# EAGLE board hot-wand (EAGLE 7.6.0)
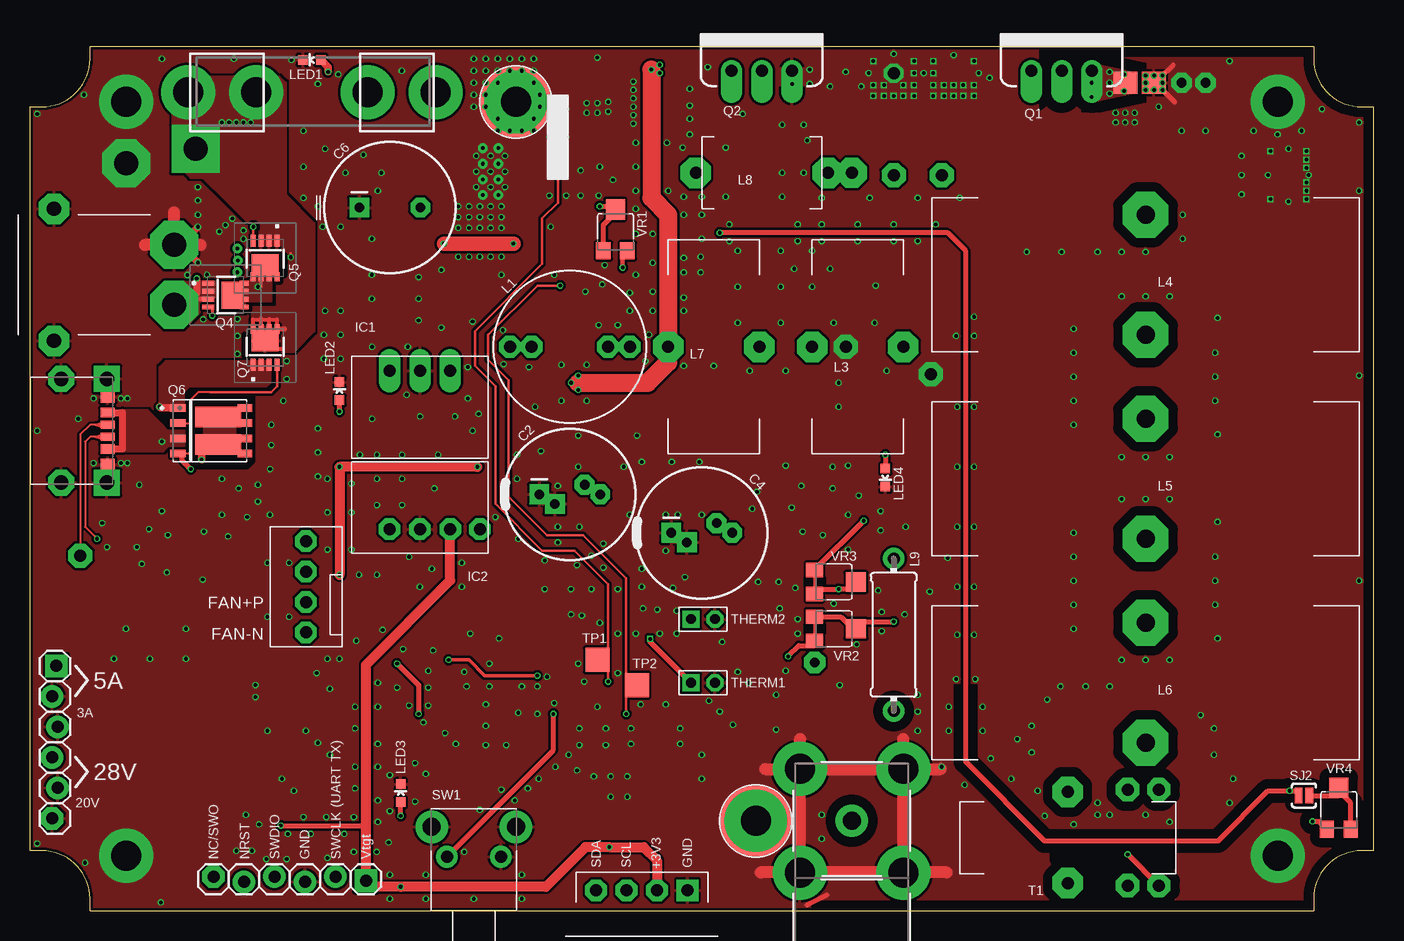
[diagram p2: board, top side]
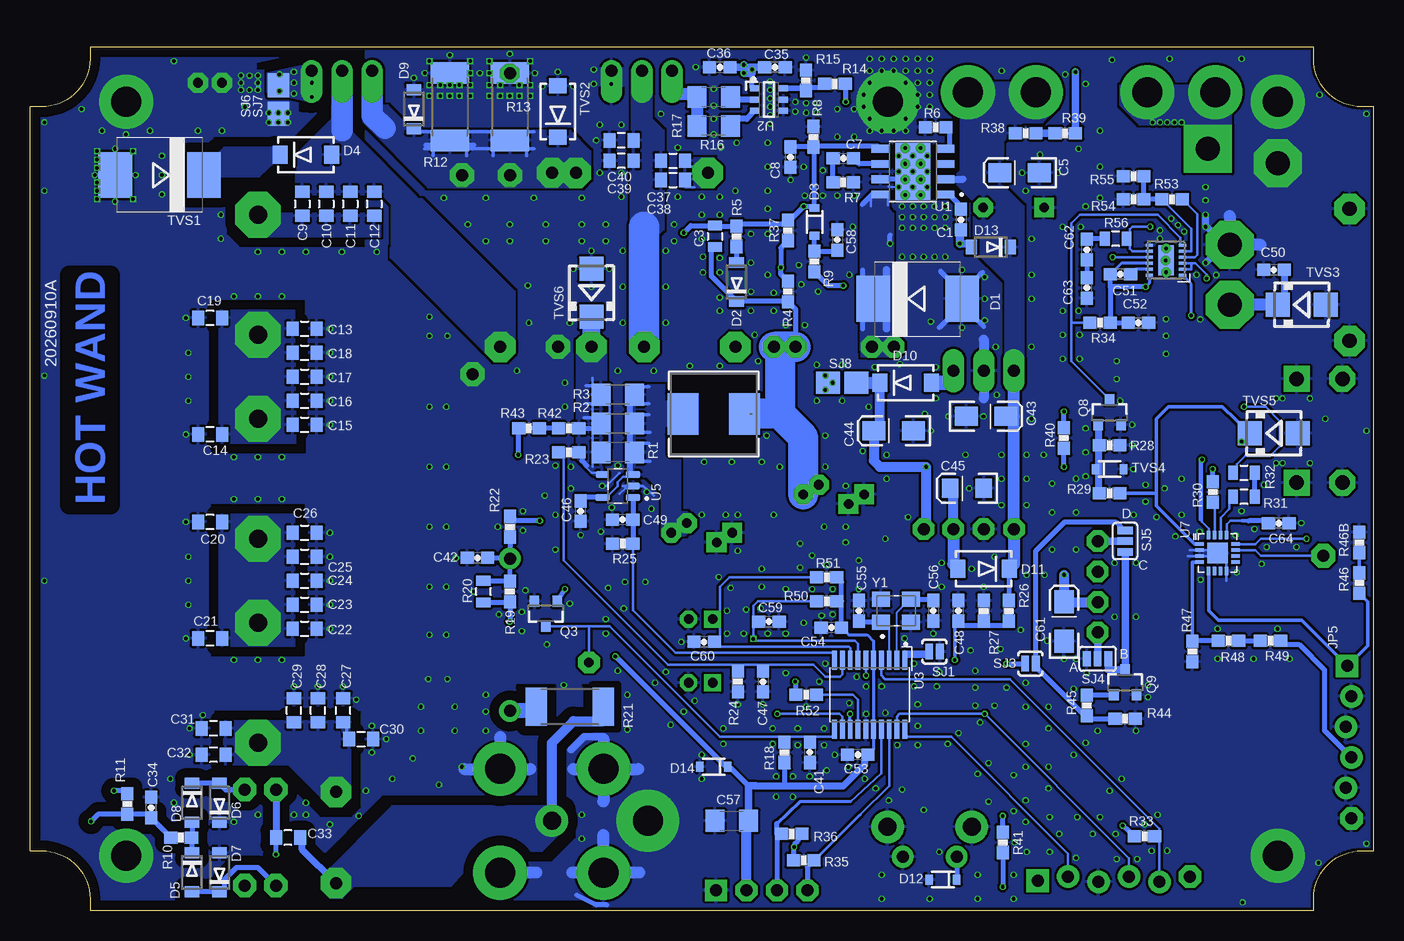
[diagram p3: board, bottom side, seen from below]

Size 112 x 72 mm. Coordinates in mm from the lower left corner, seen from the top.
Copper layers (1*16): Top 0.035mm / dielectric 1.6mm / Bottom 0.035mm
Design rules "jlcpcb-2layers *": minimum track width 5mil, minimum drill 0.3mm, track to track 5mil, track to pad 5mil, pad to pad 5mil, via to via 5mil, smd to smd 5mil, copper to edge 0.2mm, drill to drill 6mil, minimum pad ring 10mil, minimum via ring 4mil, stop-mask expansion 4mil, vias tented up to drill 0.5mm, thermal gap 8mil
tRestrict: 8 lines
bRestrict: 4 lines

## Footprints (pad centres in the part's own frame; a part is rotated, then mirrored left to right if it is on the bottom)
0603-CAP = smd 1.1 x 1: 1 -0.85,0; 2 0.85,0
CPOL-RADIAL-COMBO-10MM = drill 0.8 pad 1.651 octagon: 1 2.54,0; 1B 1.24,0.8 | drill 0.8 pad 1.651 square: 2 -2.54,0; 2B -1.24,-0.8
0805 = smd 0.8 x 1.2: 1 -0.9,0; 2 0.9,0
EIA3216-KIT = smd 1.9 x 1.6: A 1.65,0; C -1.65,0
CPOL-RADIAL-1000UF-25V = drill 0.8 pad 1.651 octagon: 1 2.54,0 | drill 0.8 pad 1.651 square: 2 -2.54,0
0805-L = smd 1 x 1.2: 1 -1,0; 2 1,0
EIA3216 = smd 1.4 x 1.6: A 1.4,0; C -1.4,0
1206 = smd 1.6 x 1.8: 1 -1.4,0; 2 1.4,0
SMC = smd 2.8 x 3.8: A 3.7,0; C -3.7,0
SOD123FL = smd 0.91 x 1.22: A 1.625,0; C -1.625,0
SOD-323 = smd 0.63 x 0.83: 1 -1.15,0; 2 1.15,0
SMA-DIODE = smd 1.27 x 1.47: A -2.15,0; C 2.15,0
FUSE_5MM = drill 2.5 pad 3.556: 1 0,-10.3; 2 0,-4.658; 3 0,4.658; 4 0,10.3
FAN-CONN-X4 = drill 1 octagon: G 0,3.8; P 0,-3.8; T 0,-1.27; V 0,1.27
TO220-BUCK-12V = drill 1 long: 1 -2.54,0; 2 0,0; 3 2.54,0
TO220-BUCK-3.3V = drill 1 octagon: 1 -2.54,0; 2 0,0; 3 2.54,0
CONN_73330-0030_MOL = drill 1.5 pad 1.753: 1 0,0 | drill 2.5 pad 3.048: 2 -4.318,4.318; 3 -4.318,-4.318; 4 4.318,-4.318; 5 4.318,4.318
SAMESKY_UJC-H-G-SMT-2-P6-TR-DRILL = smd 0.7 x 1.2: A5 -0.5,3.88; B5 0.5,3.88 | smd 0.76 x 1.2: A9 1.52,3.88; B9 -1.52,3.88 | smd 1 x 1.2: A12 2.85,3.88; B12 -2.85,3.88 | drill 1.2 pad 2 square: M1 -4.32,3.8; M3 4.32,3.8 | drill 1.2 pad 2 octagon: M2 -4.32,0; M4 4.32,0
XT30PW = drill 1.2 pad 2.54 octagon: M1 -5.5,0; M2 5.5,0 | drill 2 pad 4 octagon: N 2.5,-10; P -2.5,-10
1X06_LOCK = drill 1 pad 1.88 square: 1 0,0 | drill 1 pad 1.88: 2 2.54,-0.354; 3 5.08,0.1; 4 7.62,-0.354; 5 10.16,0.1 | drill 1 pad 1.88 octagon: 6 12.7,-0.354
IND_RADIAL_D12.7_COMBO = drill 1 octagon: 1 -3.175,0; 1B -5,0; 2 3.175,0; 2B 5,0
IND_IHLP-2525CZ_VIS-M = smd 2.616 x 3.429: 1 -2.565,0; 2 2.565,0
IND_K16X8X6_X2 = drill 1 pad 2.54 octagon: 1 0,3.8; 2 0,-3.8
IND_T130-6_X2 = drill 1.5 pad 3.81 octagon: 1 0,5; 2 0,-5
IND-10X6MM = drill 1 pad 2.54 octagon: 1 -5.5,0; 2 5.5,0
TFI0410 = drill 1 pad 1.6: 1 -6.35,0; 2 6.35,0
LED-0603 = smd 0.8 x 0.8: A 0,-0.75; C 0,0.75
PCB-OUTLINE = drill 2.5 pad 4.2: 1 8,67.4; 2 8,4.6; 3 104,67.4; 4 104,4.6
TO220V-REAR = drill 1 offset: 1 -2.54,0; 2 0,0; 3 2.54,0
SOT23-3 = smd 0.8 x 0.9: 1 -0.95,-1; 2 0.95,-1; 3 0,1.1
POWERPAK-1212-8 = smd 0.99 x 0.405: 1 -1.435,0.99; 2 -1.435,0.33; 3 -1.435,-0.33; 4 -1.435,-0.99 | smd 0.76 x 0.405: 5 1.55,-0.99; 6 1.55,-0.33; 7 1.55,0.33; 8 1.55,0.99 | smd 1.725 x 2.235: 9 0.558,0
POWERPAK-SO8-X2 = smd 1.27 x 0.61: 1 -2.67,1.905; 2 -2.67,0.635; 3 -2.67,-0.635; 4 -2.67,-1.905 | smd 1.2 x 0.61: 5 2.9,-1.905; 6 2.9,-0.635; 7 2.9,0.635; 8 2.9,1.905 | smd 3.81 x 1.7: 9 0.69,-1.15; 10 0.69,1.15
0603-RES = smd 1.1 x 1: 1 -0.85,0; 2 0.85,0
R2512 = smd 1.8 x 3.2: 1 -2.8,0; 2 2.8,0
SJ_2S-NO = smd 0.635 x 1.27: 1 -0.45,0; 2 0.45,0
SJ_3 = smd 0.635 x 1.27: 1 -0.9,0; 2 0,0; 3 0.9,0
1206-SJ = smd 2 x 1.8: 1 -1.2,0; 2 1.2,0
STANDOFF-M2.5-4.5MMHEX = drill 2.5 pad 5.2: 1 0,0 | smd 6 x 6: 2 0,0
SW_1-1825027-1 = drill 1: 1 -2.25,0; 2 2.25,0 | drill 1.5: S1 -3.505,2.49; S2 3.505,2.49
XFORMER-K16X8X6-1:14:14 = drill 1 pad 2.54 octagon: P1 0,-3.8; P2 0,3.8 | drill 1 pad 1.93 octagon: S1A -5,4; S1B -5,-4; S2A -7.6,4; S2B -7.6,-4
1X02-2MM = drill 0.8 square: 1 -1,0 | drill 0.8 octagon: 2 1,0
PAD-SQ-2MM = smd 2 x 2: 1 0,0
SMA = smd 2 x 2: A 2,0; C -2,0
VREG_LM5017MR/NOPB = smd 1.55 x 0.6: 1 -2.7,1.905; 2 -2.7,0.635; 3 -2.7,-0.635; 4 -2.7,-1.905; 5 2.7,-1.905; 6 2.7,-0.635; 7 2.7,0.635; 8 2.7,1.905 | smd 2.95 x 4.9: 9 0,0 | drill 0.3 pad 0.3: 10 -0.65,1.95; 11 0.65,1.95; 12 -0.65,0.65; 13 0.65,0.65; 14 -0.65,-0.65; 15 0.65,-0.65; 16 -0.65,-1.95; 17 0.65,-1.95
SOT95P280X145-6N-7-V = smd 0.8 x 0.5: 1 -1.2,0.95; 2 -1.2,0; 3 -1.2,-0.95; 4 1.2,-0.95; 5 1.2,0; 6 1.2,0.95
SOP65P640X120-20N = smd 1.56 x 0.41: 1 -2.88,2.925; 2 -2.88,2.275; 3 -2.88,1.625; 4 -2.88,0.975; 5 -2.88,0.325; 6 -2.88,-0.325; 7 -2.88,-0.975; 8 -2.88,-1.625; 9 -2.88,-2.275; 10 -2.88,-2.925; 11 2.88,-2.925; 12 2.88,-2.275; 13 2.88,-1.625; 14 2.88,-0.975; 15 2.88,-0.325; 16 2.88,0.325; 17 2.88,0.975; 18 2.88,1.625; 19 2.88,2.275; 20 2.88,2.925
OLED-0.91IN-VERT = drill 1 pad 1.778 square: 1 3.81,0 | drill 1 pad 1.778 octagon: 2 1.27,0; 3 -1.27,0; 4 -3.81,0
SOT95P280X145-5N = smd 1.21 x 0.59: 1 -1.255,0.95; 3 -1.255,-0.95; 5 1.255,0.95 | smd 1.1 x 0.59: 2 -1.3,0; 4 1.3,-0.95
DRR0012E-MFG = smd 0.62 x 0.25: 1 -1.39,1.25; 2 -1.39,0.75; 3 -1.39,0.25; 4 -1.39,-0.25; 5 -1.39,-0.75; 6 -1.39,-1.25; 7 1.39,-1.25; 8 1.39,-0.75; 9 1.39,-0.25; 10 1.39,0.25; 11 1.39,0.75; 12 1.39,1.25 | smd 1.3 x 2.5: 13 0,0 | drill 0.3: 14 0,-0.991; 15 0.025,0; 16 0,0.991
QFN3030-16 = smd 0.7 x 0.3: 1 -1.5,0.75; 2 -1.5,0.25; 3 -1.5,-0.25; 4 -1.5,-0.75; 9 1.5,-0.75; 10 1.5,-0.25; 11 1.5,0.25; 12 1.5,0.75 | smd 0.3 x 0.7: 5 -0.75,-1.5; 6 -0.25,-1.5; 7 0.25,-1.5; 8 0.75,-1.5; 13 0.75,1.5; 14 0.25,1.5; 15 -0.25,1.5; 16 -0.75,1.5 | smd 1.7 x 1.7: EXP 0,0
TRIM_35WR1KLFTR_V2 = smd 1.4 x 1.2: 1 -1.7,1; 3 -1.7,-1 | smd 1.7 x 1.6: 2 1.75,0
TRIM_35WR1KLFTR_V3 = smd 1.4 x 1.2: 1 -1.7,1; 3 -1.7,-1 | smd 1.7 x 1.6: 2 1.75,0
XTAL-4SMD-3.2X2.5-V2 = smd 1.25 x 1.5: 1 -0.975,1.25; 2 -0.975,-1.25; 3 0.975,-1.25; 4 0.975,1.25

## Placement (x,y rotation side)
C1  100nF  [0603-CAP]  34.4,57.6 270 bottom
C2  100uF 50V  [CPOL-RADIAL-COMBO-10MM]  45,34.7 0 top
C3  15nF (DNP)  [0805]  54.9,56.2 270 bottom
C4  100uF 50V  [CPOL-RADIAL-COMBO-10MM]  56,31.5 0 top
C5  10u  [EIA3216-KIT]  29.5,61.5 180 bottom
C6  470uF  [CPOL-RADIAL-1000UF-25V]  30,58.6 0 top
C7  100n  [0603-CAP]  44.2,62.7 0 bottom
C8  3n3  [0603-CAP]  48.6,62.8 90 bottom
C9  100nF  [0805-L]  89.3,58.9 270 bottom
C10  100nF  [0805-L]  87.3,58.9 270 bottom
C11  100nF  [0805-L]  85.3,58.9 270 bottom
C12  100nF  [0805-L]  83.3,58.9 270 bottom
C13  100pF 1000V  [0805-L]  89.1,48.5 0 bottom
C14  100pF 1000V  [0805-L]  97,39.7 180 bottom
C15  100pF 1000V  [0805-L]  89.1,40.5 0 bottom
C16  100pF 1000V  [0805-L]  89.1,42.5 0 bottom
C17  100pF 1000V  [0805-L]  89.1,44.5 0 bottom
C18  100pF 1000V  [0805-L]  89.1,46.5 0 bottom
C19  DNP  [0805-L]  97,49.4 180 bottom
C20  47pF 1000V  [0805-L]  97,32.4 180 bottom
C21  47pF 1000V  [0805-L]  97,22.7 180 bottom
C22  47pF 1000V  [0805-L]  89.1,23.5 0 bottom
C23  47pF 1000V  [0805-L]  89.1,25.5 0 bottom
C24  47pF 1000V  [0805-L]  89.1,27.5 0 bottom
C25  47pF 1000V  [0805-L]  89.1,29.5 0 bottom
C26  100pF 1000V  [0805-L]  89.1,31.5 0 bottom
C27  47pF 1000V  [0805-L]  85.9,16.7 90 bottom
C28  47pF 1000V  [0805-L]  88,16.7 90 bottom
C29  47pF 1000V  [0805-L]  90,16.7 90 bottom
C30  47pF 1000V  [0805-L]  84.4,14.3 0 bottom
C31  47pF 1000V  [0805-L]  96.7,15.2 180 bottom
C32  DNP  [0805-L]  96.7,13 180 bottom
C33  10pF 500V  [0805-L]  90.5,6.1 180 bottom
C34  1uF  [0603-CAP]  101.9,8.6 90 bottom
C35  100n  [0603-CAP]  49.9,70.3 180 bottom
C36  1uF  [0603-CAP]  54.5,70.3 0 bottom
C37  100nF  [0805-L]  58.4,60.9 0 bottom
C38  100nF  [0805-L]  58.4,62.5 0 bottom
C39  100pF  [0805-L]  62.7,62.5 180 bottom
C40  100pF  [0805-L]  62.7,64.2 180 bottom
C41  3n3  [0603-CAP]  47,13.2 270 bottom
C42  33nF  [0603-CAP]  74.7,29.4 180 bottom
C43  10u  [EIA3216-KIT]  32.3,41.2 0 bottom
C44  10u  [EIA3216-KIT]  40,40 180 bottom
C45  10u  [EIA3216]  33.9,35.2 180 bottom
C46  1uF  [0603-CAP]  66.1,33.3 90 bottom
C47  100n  [0603-CAP]  50.9,19.1 270 bottom
C48  100n  [0603-CAP]  34.6,25 90 bottom
C49  100n  [0603-CAP]  62.6,32.6 180 bottom
C50  100n  [0603-CAP]  8.3,53.4 180 bottom
C51  100n  [0603-CAP]  21.1,53.04 180 bottom
C52  100n  [0603-CAP]  19.6,49 0 bottom
C53  100n  [0603-CAP]  43,13 180 bottom
C54  100n  [0603-CAP]  45.2,23.6 180 bottom
C55  10p  [0603-CAP]  42.9,25 90 bottom
C56  10p  [0603-CAP]  36.7,25 270 bottom
C57  10u  [1206]  53.5,7.5 0 bottom
C58  3n3  [0603-CAP]  44.7,55.9 270 bottom
C59  100n  [0603-CAP]  50.4,24.1 0 bottom
C60  100n  [0603-CAP]  55.8,22.4 180 bottom
C61  10u  [EIA3216-KIT]  25.8,24.1 90 bottom
C62  100n  [0603-CAP]  23.9,55.1 90 bottom
C63  100n  [0603-CAP]  23.9,51.9 90 bottom
C64  100n  [0603-CAP]  7.9,32.3 180 bottom
D1  STPS3L60S  [SMC]  38,51 0 bottom
D2  BZT52C24  [SOD123FL]  53.1,52.4 90 bottom
D3  SD103A  [SOD-323]  46.6,57.4 270 bottom
D4  ES1J  [SMA-DIODE]  89,63 180 bottom
D5  4148  [SOD123FL]  98.5,3.2 270 bottom
D6  4148  [SOD123FL]  98.5,9 270 bottom
D7  1N4148W  [SOD123FL]  96.2,3.2 90 bottom
D8  4148  [SOD123FL]  96.2,9 90 bottom
D9  STPS0540Z  [SOD123FL]  80,66.8 90 bottom
D10  2A  [SMA-DIODE]  39,44 180 bottom
D11  [SMA-DIODE]  32.5,28.5 0 bottom
D12  3V6  [SOD-323]  35.9,2.6 180 bottom
D13  2A 60V  [SOD123FL]  31.9,55.3 180 bottom
D14  3V6  [SOD-323]  55,12 180 bottom
F1  8A 20x5mm  [FUSE_5MM]  23.5,68.2 270 top
FAN1  FAN-CONN-X4-CONN-X4  [FAN-CONN-X4]  23,27 180 top
IC1  12V R-78K12-2.0  [TO220-BUCK-12V]  32.5,45 0 top
IC2  3V3 R-78K3.3  [TO220-BUCK-3.3V]  32.5,31.8 0 top
JP1  COAX-FTYPE-PCB-MNT  [CONN_73330-0030_MOL]  68.5,7.5 180 top
JP2  USBC-CHGONLY-4M-DRILL  [SAMESKY_UJC-H-G-SMT-2-P6-TR-DRILL]  2.6,40 270 top
JP3  XT-CONNECTOR-XT30PW  [XT30PW]  2,53 90 top
JP4  [1X06_LOCK]  28,2.5 180 top
JP5  [1X06_LOCK]  2.2,20.4 270 top
L1  33u  [IND_RADIAL_D12.7_COMBO]  45,47 0 top
L2  4u7 IHLP2525CZ  [IND_IHLP-2525CZ_VIS-M]  55,41.4 180 bottom
L3  9uH  [IND_K16X8X6_X2]  69,47 270 top
L4  180nH  [IND_T130-6_X2]  93,53 0 top
L5  400nH  [IND_T130-6_X2]  93,36 0 top
L6  540nH  [IND_T130-6_X2]  93,19 0 top
L7  9uH  [IND_K16X8X6_X2]  57,47 270 top
L8  180nH  [IND-10X6MM]  61,61.5 0 top
L9  22uH  [TFI0410]  72,23 90 top
LED1  LED  [LED-0603]  23.5,70.9 90 top
LED2  LED  [LED-0603]  25.8,43.3 0 top
LED3  LED  [LED-0603]  30.9,9.8 0 top
LED4  LED  [LED-0603]  71.3,36.1 180 top
PCB1  PCB-OUTLINE  [PCB-OUTLINE]  0,0 0 top
PCB2  PCB-ART-VERSION  [PCB-ART-VERSION]  107,43.6 270 bottom
Q1  STP19NF20  [TO220V-REAR]  86,70 0 top
Q2  IRF510  [TO220V-REAR]  61,70 0 top
Q3  BC846B  [SOT23-3]  69,24.8 180 bottom
Q4  SIS862ADN-T1-GE3  [POWERPAK-1212-8]  16.3,51.3 0 top
Q5  SIS862ADN-T1-GE3  [POWERPAK-1212-8]  19.6,54.4 270 top
Q6  DMTH64M2LPDWQ-13  [POWERPAK-SO8-X2]  15,40 0 top
Q7  SIS862ADN-T1-GE3  [POWERPAK-1212-8]  19.6,46.94 90 top
Q8  2N7002K  [SOT23-3]  22,41.5 0 bottom
Q9  G3404  [SOT23-3]  20.7,19 0 bottom
R1  0R1  [1206]  63,38.2 180 bottom
R2  0R1  [1206]  63,40.6 180 bottom
R3  0R1  [1206]  63,43 180 bottom
R4  22K  [0603-RES]  48.8,51.6 270 bottom
R5  1K  [0603-RES]  53.1,56.2 270 bottom
R6  270K  [0603-RES]  36.5,65.3 0 bottom
R7  22K  [0603-RES]  44.2,60.7 180 bottom
R8  1K  [0603-RES]  46.7,64.5 270 bottom
R9  2K2  [0603-RES]  46.6,54.1 90 bottom
R10  100Ω  [0603-RES]  99.4,6.1 180 bottom
R11  2K2  [0603-RES]  103.9,8.9 270 bottom
R12  150Ω 2W  [R2512]  77,67 270 bottom
R13  DNP  [R2512]  72,67 270 bottom
R14  100Ω  [0603-RES]  44.9,68.9 180 bottom
R15  4K7  [0603-RES]  47.3,69.2 270 bottom
R16  3R6  [1206]  55,67.8 180 bottom
R17  3R6  [1206]  55,65.4 180 bottom
R18  4K7  [0603-RES]  49.1,13.2 270 bottom
R19  470Ω  [0603-RES]  72,26.6 90 bottom
R20  DNP  [0805]  74.2,26.6 90 bottom
R21  22Ω  [R2512]  67,17 180 bottom
R22  2K2  [0603-RES]  72,32 270 bottom
R23  22K  [0603-RES]  67.1,38.2 0 bottom
R24  2K2  [0603-RES]  53,19.1 90 bottom
R25  82K  [0603-RES]  62.6,30.6 0 bottom
R26  22K  [0603-RES]  30.4,25 90 bottom
R27  2K2  [0603-RES]  32.5,25 270 bottom
R28  4K7  [0603-RES]  22,38.8 180 bottom
R29  4K7  [0603-RES]  22,34.8 180 bottom
R30  4K3  [0603-RES]  13.4,34.9 270 bottom
R31  100Ω  [0805]  10.8,34.5 180 bottom
R32  100Ω  [0805]  10.8,36.5 0 bottom
R33  4K7  [0603-RES]  19.1,6.2 180 bottom
R34  22K  [0603-RES]  22.8,49 0 bottom
R35  4K7  [0603-RES]  47.5,4.2 180 bottom
R36  4K7  [0603-RES]  48.5,6.4 0 bottom
R37  DNP  [0603-RES]  48.8,56.7 270 bottom
R38  22K  [0603-RES]  29,64.8 0 bottom
R39  DNP  [0603-RES]  25.7,64.8 0 bottom
R40  4K7  [0603-RES]  25.8,39.4 90 bottom
R41  1K  [0603-RES]  30.9,5.7 90 bottom
R42  22K  [0603-RES]  67.1,40.2 180 bottom
R43  DNP  [0603-RES]  70.4,40.2 180 bottom
R44  4K7  [0603-RES]  20.7,16 0 bottom
R45  470Ω  [0603-RES]  23.9,17.1 90 bottom
R46  DNP  [0603-RES]  1.2,27.3 90 bottom
R46B  DNP  [0603-RES]  1.2,30.7 90 bottom
R47  39K  [0603-RES]  15.1,21.6 270 bottom
R48  3K  [0603-RES]  12.1,22.5 0 bottom
R49  75K  [0603-RES]  8.6,22.5 0 bottom
R50  2K2  [0603-RES]  45.6,25.8 0 bottom
R51  2K2  [0603-RES]  45.6,27.8 0 bottom
R52  100Ω  [0603-RES]  47.3,18 180 bottom
R53  82K  [0603-RES]  16.8,59.3 0 bottom
R54  3K  [0603-RES]  20,59.3 180 bottom
R55  22K  [0603-RES]  20,61.2 180 bottom
R56  100Ω  [0805]  21.5,56 180 bottom
SJ1  [SJ_2S-NO]  36.6,21.6 180 bottom
SJ2  [SJ_2S-NO]  106.2,9.6 180 top
SJ3  [SJ_2S-NO]  28.6,20.6 180 bottom
SJ4  [SJ_3]  23,21 0 bottom
SJ5  [SJ_3]  20.7,30.8 90 bottom
SJ6  SJ-SMALL-1206-SJ  [1206-SJ]  92.5,69 180 top
SJ7  SJ-SMALL-1206-SJ  [1206-SJ]  91.3,67.6 90 bottom
SJ8  SJ-SMALL-1206-SJ  [1206-SJ]  44.3,44 180 bottom
STANDOFF1  STANDOFF-M2.5-4.5MMHEX  [STANDOFF-M2.5-4.5MMHEX]  40.5,67.4 0 top
STANDOFF2  STANDOFF-M2.5-4.5MMHEX  [STANDOFF-M2.5-4.5MMHEX]  60.5,7.5 0 top
SW1  [SW_1-1825027-1]  37,4.5 0 top
T1  [XFORMER-K16X8X6-1:14:14]  86.5,6.1 180 top
THERM1  10K/~3950  [1X02-2MM]  56.1,19 0 top
THERM2  10K/~3950  [1X02-2MM]  56.1,24.3 0 top
TP1  TEST-POINT-SQ-2MM  [PAD-SQ-2MM]  47.3,20.9 0 top
TP2  TEST-POINT-SQ-2MM  [PAD-SQ-2MM]  50.6,18.8 0 top
TVS1  SM15T150CA  [SMC]  101.2,61.3 180 bottom
TVS2  SMBJ15CA  [SMA-DIODE]  68,66.6 270 bottom
TVS3  36V  [SMA]  6,50.5 0 bottom
TVS4  15V  [SOD-323]  22,36.8 0 bottom
TVS5  36V  [SMA]  8.3,39.8 0 bottom
TVS6  SMAJ24CA  [SMA]  65.2,51.5 90 bottom
U1  TPS54560DDA  [VREG_LM5017MR/NOPB]  38.4,61.6 180 bottom
U2  1EDN8511BXUSA1  [SOT95P280X145-6N-7-V]  50.4,67.6 0 bottom
U3  STM32F042F6P6  [SOP65P640X120-20N]  42,18 270 bottom
U4  SSD1306-4PIN-0.91N-VERT  [OLED-0.91IN-VERT]  51,1.7 0 top
U5  INA138  [SOT95P280X145-5N]  63,35.4 180 bottom
U6  LM74810QDRRRQ1  [DRR0012E-MFG]  17.3,54.2 180 bottom
U7  AP53781  [QFN3030-16]  13,29.8 0 bottom
VR1  10K  [TRIM_35WR1KLFTR_V2]  48.8,56.7 90 top
VR2  1K  [TRIM_35WR1KLFTR_V3]  67.1,23.5 0 top
VR3  1K  [TRIM_35WR1KLFTR_V3]  67.1,27.4 0 top
VR4  5K  [TRIM_35WR1KLFTR_V2]  109.1,8.5 90 top
Y1  27.12 MHz 10pF  [XTAL-4SMD-3.2X2.5-V2]  39.8,25 90 bottom

## Tracks (layer width: path | path; a pad name or v marks a point on that pad's centre or on a via)
3.3V  (via drill 0.3)
  Top 0.254: VR2.1 VR2.3
  Top 0.406: v20.9,7.1 28,7.1 | v63.2,21.2 64.1,22.1 65.4,22.1 VR2.3 | VR2.1 67.6,24.5 68.6,23.5 VR2.2 69.45,24.1 v72,24.1
  Top 0.813: IC2.3 35.04,27.54 28,20.5 28,7.1 JP4.1 28.5,2 v30.9,2 43,2 46.3,5.3 v48.3,5.3 51.16,5.3 52.27,4.19 U4.2
  Bottom 0.203: C57.2 52.35,7.4 52.27,7.4
  Bottom 0.254: C54.1 43.75,23 42.2,23 41.67,22.48 U3.5 U3.16 41.67,13.47 C53.1
  Bottom 0.406: R18.2 49.1,10.4 | R33.2 v20.9,7.1 | C54.1 44.35,25.8 | 44.35,25.8 44.35,27.4 R51.2 | R50.2 44.35,25.8 | v63.2,21.2 53.9,11.9 53.8,11.9 | 53.8,11.9 53.6,11.9 52.1,10.4 | D14.1 53.8,11.95 53.8,11.9 | R36.2 48,6.05 48,5.8 48.3,5.5 v48.3,5.3 48.3,4.25 R35.2 | R41.1 v30.9,2 | v72,24.1 R19.1 72,25.7 R20.1
  Bottom 0.6: 51.47,10.4 49.1,10.4 44.2,10.4 42.4,12.2 42.4,12.75 C53.1
  Bottom 0.61: 51.47,10.4 52.1,10.4 C57.2
  Bottom 0.813: U4.2 52.27,7.4 | IC2.3 35.04,35.2 C45.A
  Bottom 1: IC2.3 35.04,28.89 D11.A
12V-2
  Bottom 1.2: D10.A 35.04,44 IC1.3
12V-FOR-GATE-DRIVER  (via drill 0.3)
  Top 0.406: v45.7,44.6 45.7,44 | v45.7,43.4 45.7,44 | v45.1,44 45.7,44
  Top 1.5: v51.8,70.1 51.8,59.4 53.2,58 L7.2 53.2,45.7 51.5,44 45.7,44
  Bottom 0.406: 51.6,68.5 U2.1 51.8,68.55 51.8,69.8 | SJ8.2 45.6,44 | SJ8.2 45.7,44 | SJ8.2 v45.1,44
  Bottom 0.61: C36.2 C35.2 51.8,70.3 v51.8,70.1 51.8,69.8 v52.5,69.8 v52.5,70.5
+12V  (via drill 0.3, 1 pad 1.8)
  Top 0.813: v37.3,37 v25.8,37 v25.8,28
  Bottom 0.406: v25.8,37 R40.1
  Bottom 0.813: D10.C 41.15,40 C44.A 41.65,37.5 41.15,37 v37.3,37 37.3,31.9 v37.5,31.8 | v25.8,28 C61.A 25.8,25.73 FAN1.V
  Bottom 1: SJ8.1 D10.C
+24V
  Bottom 0.203: 64.4,36.5 65.2,36.5 65.7,37 | 65.1,37 65.1,44.4 | 63.7,42.5 63.7,38.6 64.1,38.2 R1.2
  Bottom 0.305: 64.84,43.74 65.66,43.74 | 64.82,42.26 65.64,42.26 | 64.98,41.08 65.8,41.08
  Bottom 0.406: 66,37.9 66,37.5 65.6,37.1 | 66.3,40.2 R42.1 64.9,40.2
  Bottom 1.5: L3.2 TVS6.C
  pour Bottom (isolate 0.4, rank 2): 64,47.5 64,43.5 64.3,43.2 64.3,36.2 64.9,36.2 66.4,37.7 66.4,47.5
BTN  (via drill 0.3)
  Top 0.406: SW1.1 43.63,13.38 v43.63,16.4
  Bottom 0.203: U3.13 43.63,15.12
  Bottom 0.254: 43.63,15.12 v43.63,16.4
  Bottom 0.406: SW1.1 D12.1
BUCK-1ST-STAGE
  Bottom 0.406: L1.2 48.17,50.12 R4.2 48.83,50.77 D2.C 55.2,52.88 55.2,55.3 C3.2
  Bottom 0.813: C2.1 46.74,35.5 C2.1B
  Bottom 2.5: 49.5,41.4 49.5,47 L1.2B L1.2 | 49.5,41.4 L2.1 | C2.1 47.54,39.44 49.5,41.4
BUCK-FB  (via drill 0.3)
  Top 0.406: v57.5,56.5 76.5,56.5 78,55 78,12.4 84.6,5.8 99,5.8 103.2,10 v105,10 105.75,10 SJ2.2 | v47.5,58.7 48.8,58.7 VR1.2 48.8,58.15 47.8,57.15 VR1.1
  Bottom 0.406: U1.5 41.3,63.7 46.6,63.7 | 46.6,63.7 46.7,63.7 R8.2 C8.2 | v57.5,56.5 56.9,57.1 C3.1 54.9,57 53.1,57 R5.1 53.1,57.2 49.15,57.2 R37.1 48.65,57.55 v47.5,58.7 46.6,58.7 D3.1 46.6,63.7 | R11.1 103.9,10 v105,10
BUCK-SENS-MCU
  Bottom 0.203: U3.9 44.27,19.7 44.48,19.5 45.7,19.5 46.7,20.5 50.9,20.5 | 50.9,20.5 53,20.5 | 53,20.5 58.8,20.5 67.52,29.22 67.52,38.2 R23.1 | C47.1 50.9,20.5 | R24.2 53,20.5
BUCK-SWITCH-NODE  (via drill 0.3)
  Top 1.2: v34.5,55.6 v40.3,55.6
  Bottom 0.203: 40.5,58.8 40.5,59.7 41.5,59.7 | 41.9,58.7 41.9,59.6
  Bottom 0.406: 41.5,59.7 41.78,59.7 42.62,58.86 | 42.6,53.4 42.6,48.5 | C1.2 34.5,56.55 | v40.3,55.6 40.3,56.3
  Bottom 0.61: 40.62,53.4 40.62,48.5 | v34.5,55.6 33.52,55.6 D13.A
  Bottom 0.7: 34.5,56.55 v34.5,55.6
  pour Bottom (isolate 0.254, rank 2, no thermals): 41,46.7 42.7,46.7 42.7,58.9 41.8,59.8 40.5,59.8 40.5,58.5 40.1,58.1 40.1,47.6
  pour Bottom (isolate 0.203, rank 3, no thermals): 40.1,48.6 40.1,46.2 42.7,46.2 42.7,48.6
CURR-SENS-MCU
  Bottom 0.203: U3.10 44.92,21.5 58.19,21.5 61.75,25.06 R25.2
  Bottom 0.406: U5.1 C49.1 R25.2
CURR-SENS-POSI
  Bottom 0.152: 61.74,36.16 U5.3
  Bottom 0.203: 63.95,34.45 63.02,35.38 63.02,35.72 62.58,36.16 61.74,36.16 | 61.9,36.4 61.85,36.35 U5.3
  Bottom 0.254: 62.1,36.4 61.8,36.4 U5.3
  Bottom 0.305: 61.9,36.4 61.9,42.5 | 61,42.26 60.4,42.26 | 61,41.34 60.4,41.34 | 60.92,39.86 60.32,39.86 | 61,38.94 60.4,38.94 | 60.9,37.46 60.3,37.46 | 61,43.66 60.4,43.66 | 62.1,36.4 62.1,42.5
  Bottom 0.406: C46.2 66.1,34.45 U5.5 63.95,34.45
  pour Bottom (isolate 0.4, rank 2): 61.8,36.2 60.6,36.2 59.3,34.9 59.3,30.7 57.8,30.7 57.8,43.8 61.8,43.8
  pour Bottom (isolate 0.203, rank 3, no thermals): 59.3,33.2 57.22,33.2 56.9,32.88 56.9,31.81 57.41,31.3 59.3,31.3
  pour Bottom (isolate 0.203, rank 3, no thermals): 56.8,42.4 59.8,42.4 59.8,40.4 56.8,40.4
DC-IN
  Bottom 0.406: 30.35,28.75 D11.C | 30.4,28.95 D11.C | R26.2 30.35,25.9 D11.C
  Bottom 0.6: 36.1,60.96 34.2,60.96
  Bottom 1: D11.C 29.96,28.89 IC2.1 29.96,41.2 | 29.96,41.2 IC1.1 | C43.A 29.96,41.2
  pour Bottom (isolate 0.254, rank 2): 29.2,58.7 29.2,43.4 30.7,43.4 30.7,52.5 33.3,55.1 33.3,59.1 34.9,60.7 36.3,60.7 36.3,61.2 34.9,61.2 34.4,61.7 34.4,69 26.4,69 26.4,66.9 27.5,65.8 29.2,65.8 30.9,64.1 30.9,60.4
  pour Bottom (isolate 0.203, rank 3, no thermals): 28,69 34.4,69 34.4,65.6 27.6,65.7 26.4,66.9 26.4,67.4
  pour Bottom (isolate 0.203, rank 3, no thermals): 29.2,47.4 30.7,47.4 30.7,43.9 29.2,43.9
DC-SENS-MCU  (via drill 0.3)
  Top 0.305: v42.3,19.6 37.9,19.6 36.6,20.9 v34.9,20.9
  Bottom 0.203: U3.6 42.33,19.62 v42.3,19.6 | 34.9,23.7 34.6,23.8 C48.1 | 30.4,23.8 R26.1 | R27.2 32.5,23.8
  Bottom 0.305: v34.9,20.9 34.9,24.15 C48.1
  Bottom 0.406: 34.6,23.8 32.5,23.8 30.4,23.8
DC-SRC  (via drill 0.3, 2 pad 4)
  Top 0.203: v21.74,54.46 21.74,54.8
  Top 0.305: 18.6,49.26 20.58,49.26
  Top 0.35: 18.6,48.26 18.6,49.26 | 20.58,49.26 20.58,48.24 | 19.26,48.82 19.26,49.34 | 19.94,48.78 19.94,49.3 | 21.08,46.8 20.56,46.8
  Top 0.406: 18.61,48.5 Q7.8 | 20.6,48.5 21.2,48.5
  Bottom 0.203: U6.9 v21.74,54.45 v21.74,54.46
  other vias: 16.6,65.7 17.2,65.7 17.8,65.7 18.4,65.7 13.8,63.5 16,65.7
  pour Top (isolate 0.305, rank 4): 18.5,46.6 18.5,57 12.2,63.3 12.2,65 21.3,65 21.3,59.7 23.7,57.3 23.7,48.3 22,46.6
  pour Top (isolate 0.305, rank 2, no thermals): 21.3,61.1 13.4,61.1 11.9,62.6 11.9,68 14.4,69.5 20.78,69.5 21.3,68.98
  pour Bottom (isolate 0.254, rank 2, no thermals): 11.9,68.8 11.9,65.5 19.48,65.5 21.1,67.12 21.1,68.8
  pour Top (isolate 0.203, rank 2, no thermals): 19.16,55.6 19.16,56.6 19.44,56.88 21.12,56.88 21.12,55.46 19.16,55.46
FAN-CTRL-SIG
  Bottom 0.406: R44.1 23.85,16 R45.1 24.05,16.25 28.15,20.35 SJ3.1 28.15,30 25.75,32.4 21.5,32.4 20.8,31.7 SJ5.3
GND  (via drill 0.3, 0.8 pad 1.68, 1 pad 1.6, 1 pad 2, 2 pad 4)
  Top 0.406: 94.3,68.5 95.4,67.4 | 94.2,69.4 95.3,70.5 | 66.4,1.3 64.8,0.5
  Top 0.6: 12.4,55.4 12.5,55.5 | 12.5,55.5 v14,57 | 12.5,55.5 v14,54
  Top 1.016: 64.2,3.2 64.2,14.3 | 76.4,3.2 64.2,3.2 | 64.2,3.2 60.9,3.2 | 61.3,11.8 75.9,11.8 | 72.8,3.1 72.8,14.3 | 14.2,55.5 12.5,55.5 JP3.N | JP3.N 9.6,55.5 | JP3.N 12,58.2
  Bottom 0.152: 40.44,60.34 39.66,60.34
  Bottom 0.203: 61.6,35.22 62.36,35.22 62.84,34.74 | 62.86,36.46 62.88,36.46 63.94,35.4 v64.3,35.4 | 15.3,30.04 13.5,30.04 13.26,29.8 U7.EXP | 15.5,29.56 13.4,29.56 | 12.26,27.5 12.26,29.3
  Bottom 0.254: 62.58,35.4 60.9,35.4 60,34.6
  Bottom 0.406: 39.1,61 41.1,61 U1.7 | 33.2,52.5 33.2,52.6 32.6,53.2 | 35.1,52.5 35.3,52.5 36.1,53.3 | 35,49.6 35.2,49.6 36.2,48.6 | 33.7,49.6 33.4,49.6 32.5,48.7 | 63.9,0.5 64.8,0.5 66.4,1.3 | v93,69 v93,68.4
  Bottom 0.6: 12.4,55.5 14,57.1 v14,58 | JP3.N 12.5,55.5 v14,54
  Bottom 0.61: 64.2,14.5 65.8,14.5 66.9,13.4
  Bottom 0.813: 32.5,47.6 32.5,42.7
  Bottom 1.016: 66.8,3.2 64.2,3.2 | 64.2,3.2 61.2,3.2 | 64.2,3.2 64.2,6.3 | 64.2,14.3 64.2,11.8 | 64.2,11.8 64.2,9.1 | 64.2,11.8 61.3,11.8 | 75.8,11.8 70.3,11.8 | 9.4,55.5 JP3.N | JP3.N 12.4,55.5 13.4,55.5 | 12,57.9 JP3.N | 66.7,11.8 64.2,11.8 | 72.8,14.5 72.8,11.7 | 72.4,3.2 69.8,3.2
  other vias: 7.6,42.7 8.12,42.7 7.6,37.3 8.12,37.3 5.3,42.7 5.3,37.3 50.5,62 50.5,60 54.5,59.5 56,59.5 58,59.5 58,63.6 54.4,63.6 59.4,66.4 62.7,65.5 64.5,65.5 64.8,64.2 64.5,61.5 62.7,61.5 62.7,59.5 51.9,54 51.9,51.6 50,51.5 50,50 51.9,50 54.5,50 54.5,54.4 54.5,53.2 54.5,51.1 55.9,53.2 56,56 55.9,54.5 59,55 59,52 59,49 62.6,49 62.6,52 62.6,55 80,69.4 79.1,69.8 74.5,69.8 77,71.3 72,71.4 69.9,69.8 68,69.9 66.7,68.7 69.3,68.7 56.5,70.3 46.4,66.5 39.3,58.7 43.4,57 39.3,57.8 32.4,51 34.3,53.4 34.3,48.6 43.7,53 39.3,53 49,48.8 47.4,48.8 47.7,52.2 50.5,53 110.8,60 87,40.5 87,44.5 87,42.5 99,39.7 87,46.5 87,48.5 99,49.4 99,22.7 87,23.5 87,25.5 87,27.5 87,29.5 87,31.5 99,32.4 82.3,14.3 88,18.7 90,18.7 98.7,15.2 98.7,13 85.9,18.7 100.3,11 100,9 95,7.4 93,8 90,8 89,8 89,9 87,7.2 84,10 32.4,52.8 28.5,56 28.5,53 28.5,51 27.8,63 29.3,61.5 26.3,61.5 29,60 31.5,47 31.4,43 36.9,40 16.52,31.2 21.12,42.5 20.12,40.5 20.12,38.8 20.02,36.8 64,57.2 64,55.8 66,55.8 66,57.2 58.3,57.2 58.3,55.8 69,57.2 69,55.8 72,57.2 72,55.8 74,55.8 75.5,57.2 77.2,47.9 78.7,47.9 78.7,49.5 83.1,54.9 86,54.9 89,54.9 91,54.9 93,54.9 78.7,42 77.3,42 70.5,52.1 70.4,49 71.4,45 63,45 60,45 67,49 67.4,44 67.4,42 24,36.2 24,38.2 24,40.2 22.8,62 22.8,65 77.9,10.5 80.1,12.7 81.8,11 76,12 110.8,27.5 110.8,44.6 110.8,65.7 107.7,66.8 100,70.8 104,64.7 66,8 66,6 67.5,18.8 74,16.6 74,18 74,15 39.1,22.7 36.7,23.1 42.9,26.8 46,24.6 42.3,16.4 45.6,11.7 44.9,13 43.1,19.5 36.2,19.9 36.4,18.7 41,18.7 40.7,16.5 38,15.4 38,17.2 38,13.8 46.2,19.1 45.8,15.2 45.8,13.8 48,13.8 48,15.2 48.4,11.2 49.8,11.2 49.8,9.5 45.7,20.6 42.4,11 41.5,10.2 43.8,12 47,11.2 48.4,9.5 6.02,32.3 9.32,28.9 9.92,31.8 4.02,41 32.52,41.2 28.52,41 35.42,41.2 28.52,47 31.6,29.5 32.5,27 36,27 36,29 33.5,28.5 29.4,23.4 31.1,21.8 30.6,18.6 29,17 33.2,20 33.2,18.6 43.3,59.6 44.7,59.6 44.7,64.5 43.3,64.5 44.7,66.8 43.3,66.8 24.6,63.5 31,70 17,71 11,71 4.5,68 35.5,13.9 34.6,14.8 33,11.4 32.1,12.3 30,8.3 29,9.2 27,4.9 28.9,4.9 27,7.8 26.2,6.4 24.7,7.8 23.4,6.4 22.8,7.8 21.5,6.4 19.1,7.2 18,8 18.5,5 17.2,5 21.4,4.3 19.7,4.3 24.8,4.4 30,3 30,1 33,3 33,1 37,1 41,1 41,3 39.3,10.1 40.4,9.2 37.5,8.4 36.2,4.9 29,13.9 29,12 27.1,12 27.1,10.2 27.1,15.2 27.1,17 33.6,21.7 54.2,15.2 54.2,13.9 59,19.9 60.7,27.4 62.4,27.4 63.8,26.9 66.1,31.3 66.9,35.2 64.4,31.6 68.2,37.1 68.2,33 76.5,29.4 75,26.6 67,25.6 60.2,33.5 56,33 45.7,39.6 41.6,45.3 42.1,42 45.7,37 49.5,37 32.4,49.2 40,71 21,11 24,14 25,13 22,10 8.9,30.3 6.42,30.3 51,37.4 53.5,37.4 55.8,37.4 54.5,45.4 57,45.4 42.3,18.7 40.7,31 44,30.7 44,32 40.6,38 42.6,38.3 43.7,17.3 56.6,17.5 46.8,26.8 51,27 42.9,29.2 46.8,29.6 47.8,30.6 45.6,28.8 59.9,19 57.5,16.6 64,24.3 64,23.1 39.7,13.8 45.8,32 46.3,51.6 98.8,27.5 98.8,29.5 98.8,25.5 98.8,44.5 98.8,42.5 98.8,46.5 0.6,66.4 0.6,40 0.6,5.6 10.9,0.7 4.6,4 63,37.1 66.9,37 78.8,19.3 77.2,19.3 79.4,15 76.6,15 76.6,17 79.4,17 77.3,23 78.7,23 78.7,27 77.3,27 77.3,32 78.7,32 78.7,37 77.3,37 73.7,70.8 70.3,70.8 70.3,68.8 73.7,68.8 75.3,70.8 78.7,70.8 78.7,68.8 75.3,68.8 77,68.8 75.3,69.8 73.7,69.8 71.2,68.8 72.8,68.8 76.2,68.8 77.8,68.8 70.3,67.9 71.2,67.9 72,67.9 72.8,67.9 73.7,67.9 75.3,67.9 76.2,67.9 77,67.9 77.8,67.9 78.7,67.9 69.1,34.6 50.1,13.9 50.1,15.2 38.3,20.6 53.9,23.1 53.9,25 45.1,26.8 45.1,24.7 57.7,22.4 52.5,23.1 51.1,25.2 52.3,25.1 51,28.5 53.6,26.9 54.6,27.8 62.5,25.2 68.2,30.1 38.4,62.9 38.4,61.6 38.4,60.3 39.6,62.9 37.2,62.9 37.2,61.6 39.6,61.6 37.2,60.3 39.6,60.3 40.6,36 27.5,38 24.8,36 26.8,35.6 39,65 40,65 38,67 38,68 38,69 38,70 39,70 40,70 41,70 41,65 42,65 42,70 37,71 38,71 39,71 41,71 42,71 39.3,56.9 38.4,56.9 38.4,57.8 38.4,58.7 37.5,58.7 37.5,57.8 37.5,56.9 50.5,58.5 47.4,59.6 45.9,59.6 50.5,56.4 47.9,53.8 84.8,17.6 83.5,15.4 83.5,13.2 97.6,16.3 93,20.9 91,20.9 95,20.9 93,34.3 91,34.3 95,34.3 93,37.8 91,37.8 95,37.8 93,51.2 91,51.2 95,51.2 96.1,58 96.1,56 33.2,17.1 31.6,17.1 32.8,15.7 38.3,18.7 70.7,26.7 72.9,24.7 71,23.3 71,24.9 68.9,22.2 70.9,31.7 70.9,33.3 73,32 63.5,33.6 60.6,34.9 48.2,66.6 9.12,35.5 29.9,5.7 32.1,9.1 30,11.3 45.9,61.7 36.5,42.7 36.5,45.3 44.3,42.5 46.4,42.5 44.3,45.5 37.4,41.4 50.6,39.6 46.4,45.5 84.6,7.9 36.6,58.7 36.6,57.8 36.6,56.9 35.7,56.9 35.7,57.8 35.7,58.7 35.7,54.5 36.6,54.5 37.5,54.5 38.4,54.5 39.3,54.5 29,7.4 98,69 96,69 94.1,67 96,65 98,65 103.4,63.3 106.4,63.3 104.9,63.5 106.6,61.3 103.2,61.3 104.9,59.1 103.4,59.3 106.4,59.3 106.4,62.6 106.4,61.9 106.4,60.7 106.4,60 102,65 106,65 39,69 42,69 42.5,68 42.5,67 42,66 39,66 8,62.3 93,69.6 93.7,69.6 94.4,69.6 94.4,69 93.7,68.4 94.4,68.4 38.8,32.8 28.92,38 31.02,38 28.92,33.8 65.2,55 66.7,53.5 63.7,53.5 65.2,52 62.2,15.1 62.2,18 19,34.1 19,35.5 17.4,35.2 16,33 18.1,32.8 16,36 11,33.3 58.6,15.5 56,13 63,20 56,11 53,33 54,33 53,30 50,33 44,35.4 13,23.5 8,23.5 10,21 13,21 7,21 14.4,27.6 11.5,31.3 11.4,28.2 14.5,31.6 47.3,71.1 50.5,64 53.1,64 53.2,60 51.9,56.4 48.2,67.4 50.3,67 50.3,66.3 50.3,68.4 47.3,67.3 47.3,66.5 46.4,67.3 50.3,67.7 50.3,69.1 50.3,65.6 49,19.8 49,23.1 49,26.8 47.8,28.6 47.5,24 50.9,17.2 53,17.2 50.5,23.1 47.3,17 65,70.1 65,68.9 91.3,66.5 91.3,65.7 90.5,66.5 92.1,66.5 90.5,65.7 92.1,65.7 54.5,58 56,58 63.54,68.9 24.8,33.2 26.8,33.2 26.8,30.1 24.8,30.1 25.8,21 27.2,22.5 23.9,19.8 18.8,17.8 18.8,18.8 25,18.5 29,19 21.6,24.5 19.8,24.5 21.6,29 19.8,29 20,33 19.8,15 23,15 77.5,59.4 74,59.4 70,59.4 66,59.4 72,69.8 48.6,60.9 47.5,62 55,64.7 55,66 55,67.1 55,68.5 101,61.3 101,62.9 101,59.7 75.1,44.7 68,47 24.8,21 31.02,33.8 33.72,35.2 34.02,38 27.42,28 28.92,28 28.92,36 31.02,36 17.8,56 17.8,56.7 15.78,56.6 16.3,57.14 16.86,57.68 24.4,57 24.5,48 25.9,48 25.9,57 24,58.7 14.76,53 14.44,49.28 13.12,52.98 24.5,46 25.9,46 21.4,45.8 21.4,44.3 17.3,46.4 17.3,49.3 17.3,47.9 14,60.3 14,59.2 24.6,50 25.9,50 22.8,59.4 51.3,45.8 51.6,48 36.9,49.1 39.42,48.38 39.48,45.56 37,70 37,69 37,68 37,67 21.8,70.9 25.7,69.7 24,68.9
  pour Top (isolate 0.203, rank 5): 0,0 65,0 65,19 84,19 84,72 0,72
  pour Bottom (isolate 0.203, rank 5): 0,0 65,0 65,19 84,19 84,72 0,72
  pour Bottom (isolate 0.8, rank 4): 61,0 61,19 84,19 84,72 112,72 112,0
  pour Top (isolate 0.8, rank 4): 61,0 61,19 84,19 84,72 112,72 112,0
  pour Bottom (isolate 0.203, no thermals): 37.1,64.4 37.1,63.9 39.7,63.9 39.7,64.4
  pour Bottom (isolate 0.203, no thermals): 37.1,59.3 37.1,58.8 39.7,58.8 39.7,59.3
  pour Bottom (isolate 0.203, no thermals): 62.3,70.2 65.1,70.2 65.1,68.8 62.3,68.8
  pour Bottom (isolate 0.203, rank 2, no thermals): 97,65 90,65 89.7,65.3 89.7,70 97,70
  pour Top (isolate 0.203, no thermals): 65.1,70.2 62.3,70.2 62.3,68.8 65.1,68.8
MCU-BOOT0
  Bottom 0.254: U3.1 39.08,21.2 | 39.08,21.2 39.08,21.4 | 39.08,21.4 39.08,21.6 SJ1.2 | 39.08,21.4 37.05,21.4 | 39.08,21.2 37.05,21.2
MCU-OSC-IN
  Bottom 0.152: U3.2 39.73,24.89 39.2,25.41 39.11,25.41 Y1.3
  Bottom 0.406: Y1.3 36.83,25.98 C56.1
MCU-OSC-OUT
  Bottom 0.152: U3.3 40.38,24.12 Y1.1
  Bottom 0.406: Y1.1 42.88,24.02 C55.1
MCU-RF
  Bottom 0.406: R14.2 46,68.6 46.95,68.6 R15.2
  Bottom 0.457: U2.6 47.3,68.55 R15.2
N$1
  Bottom 0.6: R21.2 70.25,16.65
  Bottom 1.27: 70.25,16.65 L9.1
N$2  (via drill 0.3)
  Top 0.406: T1.S2A v91.5,4.7
  Bottom 0.406: v91.5,4.7 C33.2
  Bottom 0.6: T1.S1B C33.2
N$3
  pour Bottom (isolate 0.8, rank 2): 96.2,22.1 96.2,33 90,33 90,22.1
N$4
  Bottom 0.406: D6.A 98.5,6.15 R10.1 98.5,6.05 D5.C
N$5
  Bottom 0.406: 95.97,10.4 D8.A D6.C
  Bottom 0.457: T1.S2B 95.67,10.1 D8.A
N$6
  Bottom 0.406: 95.97,1.8 D7.C | D7.C D5.A | T1.S1A 93,3.6 94.8,3.6 95.8,2.6 95.8,1.98 D7.C
N$7
  pour Bottom (isolate 0.8, rank 2, no thermals): 96.3,61.2 92.9,61.2 91.6,62.4 90.7,62.4 90.7,63.6 95.82,63.6 96.3,63.12
N$9
  Bottom 0.406: 71.9,27.6 R19.2 | R19.2 L9.2 | C42.1 72.05,29.4 L9.2 | R22.2 L9.2 | R20.2 72,27.5 R19.2
N$10
  pour Bottom (isolate 0.8, rank 2): 96.2,50 90,50 89.9,39 96.2,39
N$11
  pour Bottom (isolate 0.8, rank 2): 82.8,58.1 94.7,58.1 94.7,57.2 93.7,56.2 82.8,56.2
N$14
  Bottom 0.5: U2.2 53.6,67.6 R16.1
N$15
  Bottom 0.406: 53.5,65.4 R17.1
  Bottom 0.5: U2.3 52.25,66 53.6,66 R17.1
N$16
  Bottom 1.016: R17.2 R16.2 56.4,68.1 58.46,68.1 Q2.1
N$17
  Bottom 0.203: 57.3,60.3 56.6,60.3 | 57.3,61.4 56.7,61.4 | 57.4,62 56.7,62
  pour Bottom (isolate 0.4, rank 2): 55,60.3 57.6,60.3 57.6,62.7 55,62.7
N$19
  Bottom 0.406: U1.6 42.88,62.23 C7.2
N$20
  Bottom 0.406: R7.2 C7.1
N$21
  Bottom 0.406: U1.4 35.3,63.51 35.3,64.95 R6.2
N$22
  Bottom 0.406: C1.1 34.4,58.7 35.4,59.7 U1.1
N$25  (via drill 0.3)
  Top 0.38: v49.4,53.6 49.4,55 VR1.3
  Bottom 0.406: R4.1 49.4,53.05 v49.4,53.6 49.4,55.25 R37.2
N$27
  Bottom 0.406: R5.2 D2.A
N$28
  Bottom 0.406: D3.2 R9.2 44.8,54.95 C58.2
N$29
  Bottom 0.406: C62.1 C63.2
N$30
  Bottom 0.203: R28.2 22.95,38.8 | TVS4.1 22.95,36.8 22.95,36.9
  Bottom 0.6: Q8.1 22.95,38.8 22.95,36.9 22.95,35 R29.2
N$35  (via drill 0.3)
  Top 0.203: Q6.8 15.69,41.91 Q6.10 15.69,40.63 Q6.7 | 15.7,39.37 15.69,39.37 Q6.9 | Q6.6 17.2,39.37 | 17.2,39.37 15.7,39.37 | 15.7,39.37 15.7,39 | Q6.5 17.2,38.09 17.2,39.37
  Top 0.61: Q6.9 14.3,38.85 v14.3,37.6
  Bottom 0.203: 14.3,32.4 v14.3,37.6 14.5,37.4 14.5,32.6 14.3,32.4 | U7.16 13.75,31.85 14.3,32.4
  pour Top (isolate 0.203, no thermals): 14.5,41.8 14.5,38.2 17.1,38.2 17.1,41.8
N$38
  Bottom 0.203: C64.2 8.95,32.5 | U7.13 12.25,32.2 11.95,32.5 11,32.5
  Bottom 0.305: 11,32.5 10.4,32.5
  Bottom 0.406: 8.95,32.5 10.4,32.5
N$40
  Bottom 0.203: R31.2 12.02,34.5 12.02,33.5 12.75,32.77 U7.14
N$43
  Bottom 0.406: R56.2 23.85,56 C62.2
N$47  (via drill 0.3)
  Top 0.406: v25.8,41.6 LED2.A
  Bottom 0.406: R40.2 v25.8,41.6
N$48  (via drill 0.3)
  Top 0.406: v30.9,7.9 LED3.A
  Bottom 0.406: R41.2 v30.9,7.9
N$49  (via drill 0.3)
  Top 0.61: v24.85,69.9 24.85,70.3 LED1.A
  Bottom 0.254: R39.1 R39.2
  Bottom 0.61: R38.2 R39.1 | R39.2 v24.85,69.9
N$50
  Top 0.406: SJ2.1 109.1,9.6 VR4.2 109.1,10 110.1,9 VR4.3
N$53
  Bottom 0.406: R45.2 23.85,18 Q9.1
N$55
  Bottom 0.305: R46.2 R46B.1
N$57
  Bottom 0.406: R31.1 R32.2
N$60
  Bottom 0.406: R48.2 R49.1
N$61
  Bottom 0.406: R49.2 7.45,22.2 6.2,22.2 4.1,20.1 4.1,15.03 JP5.4
N$62  (via drill 0.3)
  Top 0.406: v71.3,38 LED4.A
  Bottom 0.254: R43.1 R43.2
  Bottom 0.406: R42.2 R43.1 | R43.2 71.3,40.15 v71.3,38
N$63  (via drill 0.3)
  Top 0.61: Q6.1 10.89,41.91 v10.8,42
  Bottom 0.203: v10.8,42 9,42 7.8,40.8 7.8,38.7 8.6,37.9 10.7,37.9 11.4,37.2 11.4,36.5 R32.1
  pour Top (isolate 0.203, rank 3, no thermals): 10.8,41.7 10.8,45.3 11.3,45.8 20,45.8 20,44 19.7,43.7 13.3,43.7 12.8,43.2 12.8,41.7
N$65
  Bottom 0.61: SJ4.2 FAN1.G
N$67
  Bottom 0.61: SJ5.2 FAN1.P
N$68
  Bottom 0.203: U6.4 14.91,54.45 14.7,54.66 14.7,58.05 R53.2
NRST
  Bottom 0.203: U3.4 41.02,19.61 40.72,19.3 30.3,19.3 17.84,6.84 17.84,6.2 | 17.84,6.2 JP4.5 | R33.1 17.84,6.2
PWR-ATTENU  (via drill 0.3)
  Top 0.203: TP2.1 49.7,18.8 v49.7,16.4 49.7,27.7 46.1,31.3 43.1,31.3 39.9,34.5 39.9,44.2 38.2,45.9 38.2,48 42.3,52.1 v44.2,52.1
  Bottom 0.203: U3.12 44.27,16.15 44.52,16.4 v49.7,16.4
  Bottom 0.406: v44.2,52.1 45.45,52.1 R9.1
Q1-VD
  Bottom 1.8: Q1.2 86,65
  pour Bottom (isolate 0.8, rank 3): 85.2,67.1 85.2,65.2 82.8,62.8 82.8,59.7 89.8,59.7 89.8,63 86.8,66 86.8,67.1
  pour Bottom (isolate 0.8, rank 3): 72.3,45.8 73.3,45.8 81.9,54.4 81.9,58.9 82.7,59.7 85.9,59.7 85.9,62.6 82.6,62.6 71.6,51.6 71.6,46.5
Q1-VS  (via drill 0.3)
  other vias: 90,69.9 90,69 90,68.1 88.5,67.8 88.5,69 91.2,69.7 91.2,68.3
  pour Top (isolate 0.203, no thermals): 88.5,70.6 92.2,69.8 92.2,68.2 88.5,67.4
  pour Bottom (isolate 0.203, no thermals): 88.5,67.4 92.2,68.2 92.2,69.8 88.5,70.6
Q2-VD
  Bottom 2.54: L7.1 60.8,57
  pour Bottom (isolate 0.4, rank 2): 60.2,67.4 61.8,67.4 61.8,64.9 61.9,64.8 61.9,56 60,56 59.2,56.8 59.2,65 60.2,66
  pour Bottom (rank 3, no thermals): 60.2,70.1 60.2,66.2 61.8,66.2 61.8,70.1
Q3-VB  (via drill 0.3)
  Top 0.254: VR3.1 65.4,26.8 65.8,26.8
  Top 0.406: VR3.2 68.25,26.8 v67.4,26.8 65.8,26.8 VR3.3 | VR3.1 v69.5,32.5
  Bottom 0.406: Q3.1 v67.4,26.8 | v69.5,32.5 71.55,32.5 R22.1
Q9-VD
  Bottom 0.61: SJ4.3 22.1,20.1 Q9.3 SJ5.1
RF-FB-RECTIFIED  (via drill 0.3)
  Top 0.406: v106.9,7.45 107.45,7.45 VR4.1
  Bottom 0.406: R10.2 C34.1 102.4,8.05 R11.2 106.3,8.05 v106.9,7.45
RF-FINAL
  Bottom 0.203: 85.6,15.7 85.7,15.8 C27.1
  Bottom 0.305: 85.6,14.7 85.6,15.7
  pour Bottom (isolate 0.8, rank 2): 93.1,12.2 90.5,12.2 87,8.7 86.01,8.7 85.3,9.41 85.3,15.8 93.1,15.8
  pour Bottom (isolate 0.8, rank 2): 92.6,12.2 95.8,12.2 95.8,15.8 92.6,15.8
RF-GATE  (via drill 1 pad 2, 1 pad 2.5)
  Bottom 0.305: 70,63.5 79.1,63.5 | 70,64.9 79.6,64.9 | 73.4,63.4 73.4,62.9 | 70.6,63.4 70.6,62.9 | 78.4,63.4 78.4,62.9 | 75.6,63.4 75.6,62.9
  Bottom 0.406: 75,63.8 79,63.8
  Bottom 1.8: Q1.1 83.46,66.26 82.4,65.2
  other vias: 68.5,61.5 72,61.3 76,61.3
  pour Bottom (isolate 0.4, rank 2): 65.3,61 65.3,63.3 67,65 80.1,65 82.2,67.1 84.2,67.1 84.2,65.7 78.8,60.3 66,60.3
RF-GEN  (via drill 0.3)
  Top 0.203: v44,67.4 44,59 42.7,57.7 42.7,54 42.7,53.9 37.1,48.3 37.1,45.4 38.8,43.7 38.8,33.9 42.7,30 45.4,30 48.2,27.2 v48.2,19.1 48.2,20.9 TP1.1
  Bottom 0.406: v44,67.4 44,68.9 R14.1 | v48.2,19.1 48.2,18 R52.2
RF-GEN-
  Bottom 0.203: U3.14 42.98,17.57 43.4,18 R52.1
RF-OUT
  Bottom 0.6: T1.P2 89.3,5.1 89.3,5.8 arc-45 89.37,5.97 C33.1
  Bottom 0.813: JP1.1 68.5,14 66.7,15.8 64.2,15.8 R21.1
  pour Bottom (isolate 0.8, rank 2, no thermals): 75.9,3.2 72.02,3.2 72,5 69.32,5 67.4,6.92 67.4,7.6 arc-90 68.5,8.7 81.8,8.7 87.7,2.8 87.7,1.88 86.92,1.1 86,1.1 85,2.1 76.9,2.1
SCL
  Bottom 0.203: U3.17 41.02,11.47 43.6,9.1
  Bottom 0.254: 43.6,9.1 47.8,9.1
  Bottom 0.305: 47.8,9.1 49.73,7.27
  Bottom 0.406: 49.73,6.4 U4.3 | R36.1 49.73,6.4 | 49.73,6.4 49.73,7.27
SDA
  Bottom 0.203: U3.18 40.38,10.43 42.8,8
  Bottom 0.254: 42.8,8 46.6,4.2 R35.1
  Bottom 0.406: R35.1 47.19,3.66 U4.4
SWCLK
  Bottom 0.203: U3.20 39.08,14.5 35.2,14.5 25.46,4.76 JP4.2
SWDIO  (via drill 0.3)
  Top 0.406: v30.6,20.6 32.4,18.8 v32.4,16.4
  Bottom 0.203: U3.19 39.73,16.19 39.51,16.4 v32.4,16.4 20.38,4.38 JP4.4
  Bottom 0.406: v30.6,20.6 SJ3.2
THERM-1  (via drill 0.3)
  Top 0.406: THERM1.1 51.7,22.4 v51.7,22.66
  Bottom 0.203: U3.7 42.98,22.26 43.21,22.5 51.7,22.5 v51.7,22.66 51.7,24.1 | R50.1 51.3,25.8 51.7,25.4 51.7,24.1 | C59.1 51.7,24.1
THERM-2
  Bottom 0.203: U3.8 43.62,21.88 43.75,22 54.5,22 54.5,22.4 | 54.5,22.4 54.5,24.3 | R51.1 53.69,27.8 54.5,26.99 54.5,24.3 | C60.1 54.5,22.4 | THERM2.1 54.5,24.3
TIP-DET  (via drill 0.8 pad 1.8)
  Bottom 0.203: U3.11 44.92,14.5 47,14.5 | 47,14.5 49.1,14.5 | 49.1,14.5 54.5,14.5 63.7,23.7 65.4,23.7 | C41.1 47,14.5 | R18.1 49.1,14.5 | 65.4,23.7 Q3.3 | v65.4,20.7 65.4,23.7
U6-CAP
  Bottom 0.254: U6.11 19.84,53.45 C51.1
U6-DGATE  (via drill 0.3)
  Top 0.254: Q4.4 15.2,50.31 v15.2,49.6
  Bottom 0.254: v15.2,49.6 15.2,52.24 U6.1
U6-EN
  Bottom 0.203: U6.6 16.1,55.45 16.1,56.1 18,58 24.5,58 25.2,57.3 25.2,49 | R34.1 25.2,49 | 25.2,49 25.2,45.8 Q8.3
U6-HGATE  (via drill 0.3)
  Top 0.203: v18.61,57 Q5.4
  Bottom 0.203: U6.8 20.09,54.95 20.3,55.16 20.3,56 | v18.61,57 20.1,57 20.3,56.8 20.3,56.6 20.3,56 | R56.1 20.3,56
U6-OV
  Bottom 0.203: U6.5 15.2,54.95 15.2,56.85 R53.1
  Bottom 0.406: R53.1 R54.1 R55.1
U7-ISEL
  Bottom 0.305: U7.5 13.75,25 12.95,24.2 6,24.2 JP5.1 0.5,22.1 0.5,25.75 R46.1
U7-VGA
  Bottom 0.203: U7.15 13.25,33.9 R30.2
U7-VGA-2  (via drill 0.3)
  Top 0.152: Q6.2 13.38,40.63 | 13.38,40.63 13.38,38.23 13.25,38.09 12.7,38.09 Q6.4 | 15,43.2 14,43.2 13.38,42.58 13.38,40.63
  Top 0.203: Q7.4 20.59,43.7 20.09,43.2 15,43.2
  Top 0.406: v13.4,36.8 12.7,37.5 12.7,38.09
  Bottom 0.406: R30.1 v13.4,36.8
U7-VSEL
  Bottom 0.3: U7.4 15.1,29.05 R47.1
  Bottom 0.406: R48.1 14.95,22.5 R47.1
USB-CC1  (via drill 1 pad 2)
  Top 0.152: JP2.A5 5.4,40.5 | 5.4,40.5 5,40.5 4.2,39.7 v4.2,29.6 | 5.4,40.5 6.1,40.7 | 5.4,40.5 6.1,40.3
  Bottom 0.203: v4.2,29.6 9.4,29.6 9.85,30.05 U7.11
USB-CC2  (via drill 0.3)
  Top 0.152: JP2.B5 5.4,39.5 | 5.4,39.5 5,39.5 4.6,39.1 4.6,32 v5.6,31 | 5.4,39.5 6.1,39.7 | 5.4,39.5 6.1,39.3
  Bottom 0.203: v5.6,31 9.4,31 9.85,30.55 U7.12
USB-VBUS  (via drill 0.3)
  Top 0.6: JP2.B9 7.7,41.52 7.7,38.48 JP2.A9
  Bottom 0.203: 11,40 v11,39.1 10.3,39.1 TVS5.C
  Bottom 0.3: 18.1,34.8 18.1,33.75 14.9,30.55 U7.1 | 18.1,34.8 18.1,41 17.1,42 12.6,42 TVS5.C | R29.1 18.1,34.8
  pour Top (isolate 0.203, no thermals): 7.5,38.3 11.1,38.3 11.5,38.7 11.54,38.74 12.86,38.74 12.86,39.46 12.86,40.02 12.04,40.02 11.48,40.02 11,40.5 9.8,41.7 7.5,41.7
VCD  (via drill 0.3)
  Top 0.254: v19,52 19.27,52 Q5.6
  Bottom 0.254: U6.10 21.04,53.95 C51.2 | U6.12 18.69,52.31 v19,52
  Bottom 0.406: 22,53 21.95,53 | 21.95,52 R34.2 C52.1 | v19,52 21.95,52 | 21.95,52 21.95,53 | C51.2 21.95,53
  pour Top (isolate 0.203, rank 2, no thermals): 16.7,52.3 18.1,52.3 18.6,52.8 18.6,54 20.6,54 20.6,52.8 20.1,52.8 20.1,50.8 17.9,50.8 17.9,50.3 16.7,50.3
VIN-XT30  (via drill 0.3)
  Top 0.4: 14.2,50.97 12,50.97 JP3.P 12.5,50.5 12.5,51.63
  Top 0.6: 13,51.8 JP3.P | 13,50.53 JP3.P | 13,49.27 JP3.P | v13.9,52.7 13.9,51.5
  Bottom 0.203: U6.2 15.2,53.45 15.2,53.95 | v13.9,52.7 13.9,53 14.85,53.95 15.2,53.95 | U6.3 15.2,53.95
  Bottom 0.6: C50.1 7.45,50.5 8.5,50.5
  Bottom 1: TVS3.C 8.5,50.5 JP3.P
  pour Top (isolate 0.203, no thermals): 11.6,52.4 16.1,52.4 16.1,51.8 13.4,49.1 11.6,49.1

## Text on the board
tPlace: FAN+P | FAN-N | 5A | 3A | 28V | 20V | NC/SWO | NRST | SWDIO | GND | SWCLK (UART TX) | Vtgt | SDA | SCL | +3V3 | GND
bPlace: D | C | B | A
bValues: DNP | DNP | DNP